# EAGLE design Angin_Arus_LM2596 (EAGLE 7.6.0)
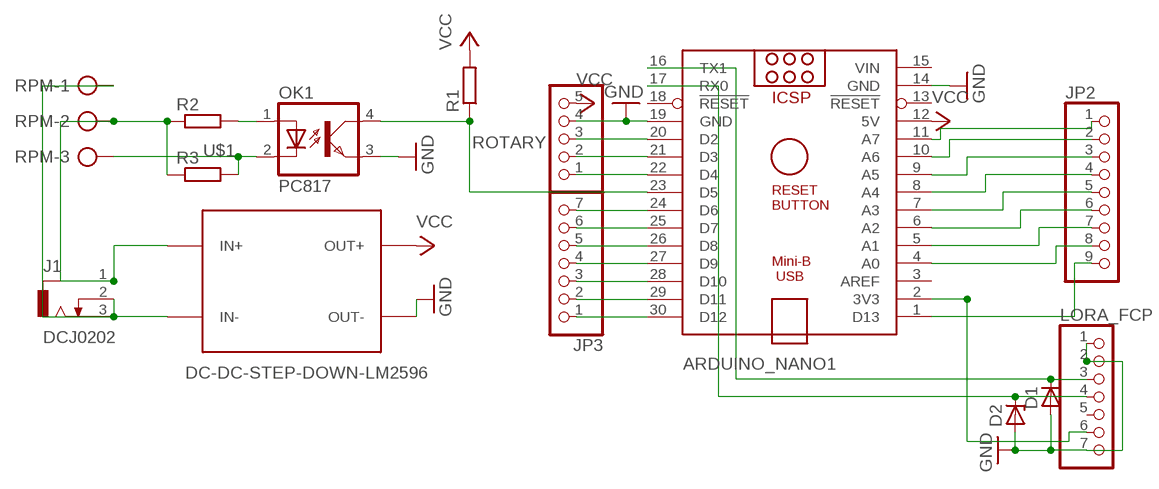
[diagram p0: schematic, sheet 1]

## Parts
ARDUINO_NANO1  ARDUINO_NANO  [ARDUINO_NANO]
D1  ZENER-DIODEDO35Z10  [DO35Z10]
D2  ZENER-DIODEDO35Z10  [DO35Z10]
J1  DCJ0202  [DCJ0202]
JP2  PINHD-1X9  [1X09]
JP3  PINHD-1X7  [1X07]
LORA_FCP  PINHD-1X7  [1X07]
OK1  PC817  [DIL04]
R1  R-EU_0204/7  [0204/7]
R2  R-EU_0204/7  [0204/7]
R3  R-EU_0204/7  [0204/7]
ROTARY  PINHD-1X5  [1X05]
RPM  AK300/3  [AK300/3]
U$1  DC-DC-STEP-DOWN-LM2596  [DC-DC-STEP-DOWN-LM2596]

## Nets
3.3V: ARDUINO_NANO1.2(3V3) LORA_FCP.6
12V: J1.1 R2.1 R3.1 RPM.2 U$1.IN+
GND: ARDUINO_NANO1.14(GND) ARDUINO_NANO1.19(GND) D1.A D2.A LORA_FCP.1 LORA_FCP.2 LORA_FCP.7 OK1.3(EMIT) ROTARY.4 U$1.OUT-
GND12V: J1.2 J1.3 RPM.1 U$1.IN-
N$1: ARDUINO_NANO1.23(D5) OK1.4(COL) R1.1
N$2: OK1.1(A) R2.2
N$4: ARDUINO_NANO1.20(D2) ROTARY.3
N$5: ARDUINO_NANO1.21(D3) ROTARY.2
N$6: ARDUINO_NANO1.22(D4) ROTARY.1
N$7: ARDUINO_NANO1.8(A4) JP2.4
N$9: ARDUINO_NANO1.1(D13) JP2.9
N$10: ARDUINO_NANO1.4(A0) JP2.8
N$11: ARDUINO_NANO1.5(A1) JP2.7
N$12: ARDUINO_NANO1.6(A2) JP2.6
N$13: ARDUINO_NANO1.7(A3) JP2.5
N$14: ARDUINO_NANO1.9(A5) JP2.3
N$15: ARDUINO_NANO1.10(A6) JP2.2
N$16: ARDUINO_NANO1.11(A7) JP2.1
N$18: ARDUINO_NANO1.30(D12) JP3.1
N$19: ARDUINO_NANO1.29(D11) JP3.2
N$20: ARDUINO_NANO1.28(D10) JP3.3
N$21: ARDUINO_NANO1.27(D9) JP3.4
N$22: ARDUINO_NANO1.26(D8) JP3.5
N$23: ARDUINO_NANO1.25(D7) JP3.6
N$24: ARDUINO_NANO1.24(D6) JP3.7
RX: ARDUINO_NANO1.16(TX1) D1.C LORA_FCP.3
SIGNAL: OK1.2(C) R3.2 RPM.3
TX: ARDUINO_NANO1.17(RX0) D2.C LORA_FCP.4
VCC: ARDUINO_NANO1.12(5V) R1.2 ROTARY.5 U$1.OUT+
Unconnected: ARDUINO_NANO1.3(AREF) ARDUINO_NANO1.13(!RESET) ARDUINO_NANO1.18(!RESET) LORA_FCP.5

## Power pins joined to a net without a drawn wire
VIN: ARDUINO_NANO1.15(VIN)

## Library data of the parts
ARDUINO_NANO1 = ArduinoNanoV30:ARDUINO_NANO: Arduino Nano V3.0 Overview: The Arduino Nano is a small, complete, and breadboard-friendly board based on the ATmega328 (Arduino Nano 3.x) or ATmega168 (Arduino Nano 2.x). It has more or less the same functionality of the Arduino Duemilanove, but in a different package. It lacks only a DC power jack, and works with a Mini-B USB cable instead of a standard one. The Nano was designed and is being produced by Gravitech. Specifications: Microcontroller Atmel ATmega168 or ATmega328 Operating Voltage (logic level) 5 V Input Voltage (recommended) 7-12 V Input Voltage (limits) 6-20 V Digital I/O Pins 14 (of which 6 provide PWM output) Analog Input Pins 8 DC Current per I/O Pin 40 mA Flash Memory 16 KB (ATmega168) or 32 KB (ATmega328) of which 2 KB used by bootloader SRAM 1 KB (ATmega168) or 2 KB (ATmega328) EEPROM 512 bytes (ATmega168) or 1 KB (ATmega328) Clock Speed 16 MHz Dimensions 0.73" x 1.70" Length 45 mm Width 18 mm Weigth 5 g Power: The Arduino Nano can be powered via the Mini-B USB connection, 6-20V unregulated external power supply (pin 30), or 5V regulated external power supply (pin 27). The power source is automatically selected to the highest voltage source. Memory: The ATmega168 has 16 KB of flash memory for storing code (of which 2 KB is used for the bootloader); the ATmega328 has 32 KB, (also with 2 KB used for the bootloader). The ATmega168 has 1 KB of SRAM and 512 bytes of EEPROM (which can be read and written with the EEPROM library); the ATmega328 has 2 KB of SRAM and 1 KB of EEPROM. Input and Output: Each of the 14 digital pins on the Nano can be used as an input or output, using pinMode(), digitalWrite(), and digitalRead() functions. They operate at 5 volts. Each pin can provide or receive a maximum of 40 mA and has an internal pull-up resistor (disconnected by default) of 20-50 kOhms. In addition, some pins have specialized functions. Visit Arduino - ArduinoBoardNano <https://www.arduino.cc/en/Main/ArduinoBoardNano>
D1 D2 = diode:ZENER-DIODE: Z-Diode
J1 = con-jack:DCJ0202: DC POWER JACK Source: DCJ0202.pdf; OC_FARNELL: unknown; OC_NEWARK: unknown
JP2 = pinhead:PINHD-1X9: PIN HEADER
JP3 LORA_FCP = pinhead:PINHD-1X7: PIN HEADER
OK1 = optocoupler:PC817: SHARP OPTO COUPLER; MPN: PC817X4J000F; OC_FARNELL: 9707727; OC_NEWARK: 97K7059
R1-R3 = rcl:R-EU_: RESISTOR, European symbol
ROTARY = pinhead:PINHD-1X5: PIN HEADER
RPM = con-ptr500:AK300/3: CONNECTOR; OC_FARNELL: unknown; OC_NEWARK: unknown
U$1 = diy-modules:DC-DC-STEP-DOWN-LM2596: DC/DC Step-Down Regulator based on LM2596-ADJ chip LM2596 datasheet available here: http://www.ti.com/lit/ds/symlink/lm2596.pdf Click here to find device on ebay.com <http://www.ebay.com/sch/lm2596+power+regulator>

## Board
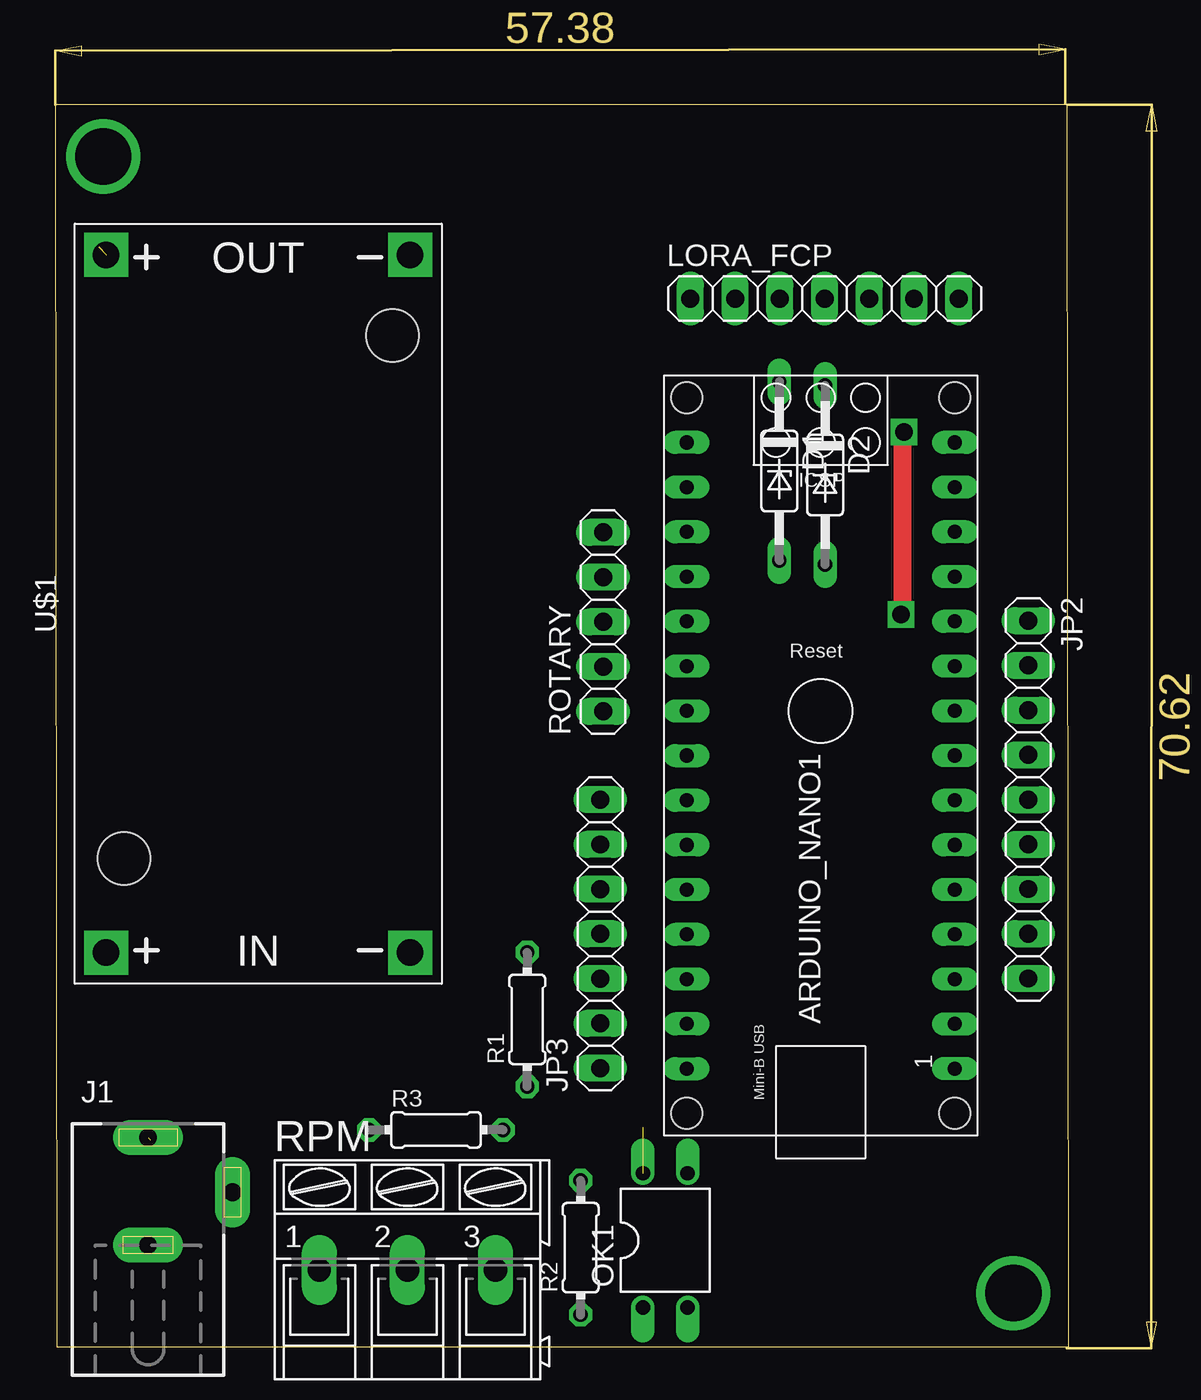
[diagram p1: board, top side]
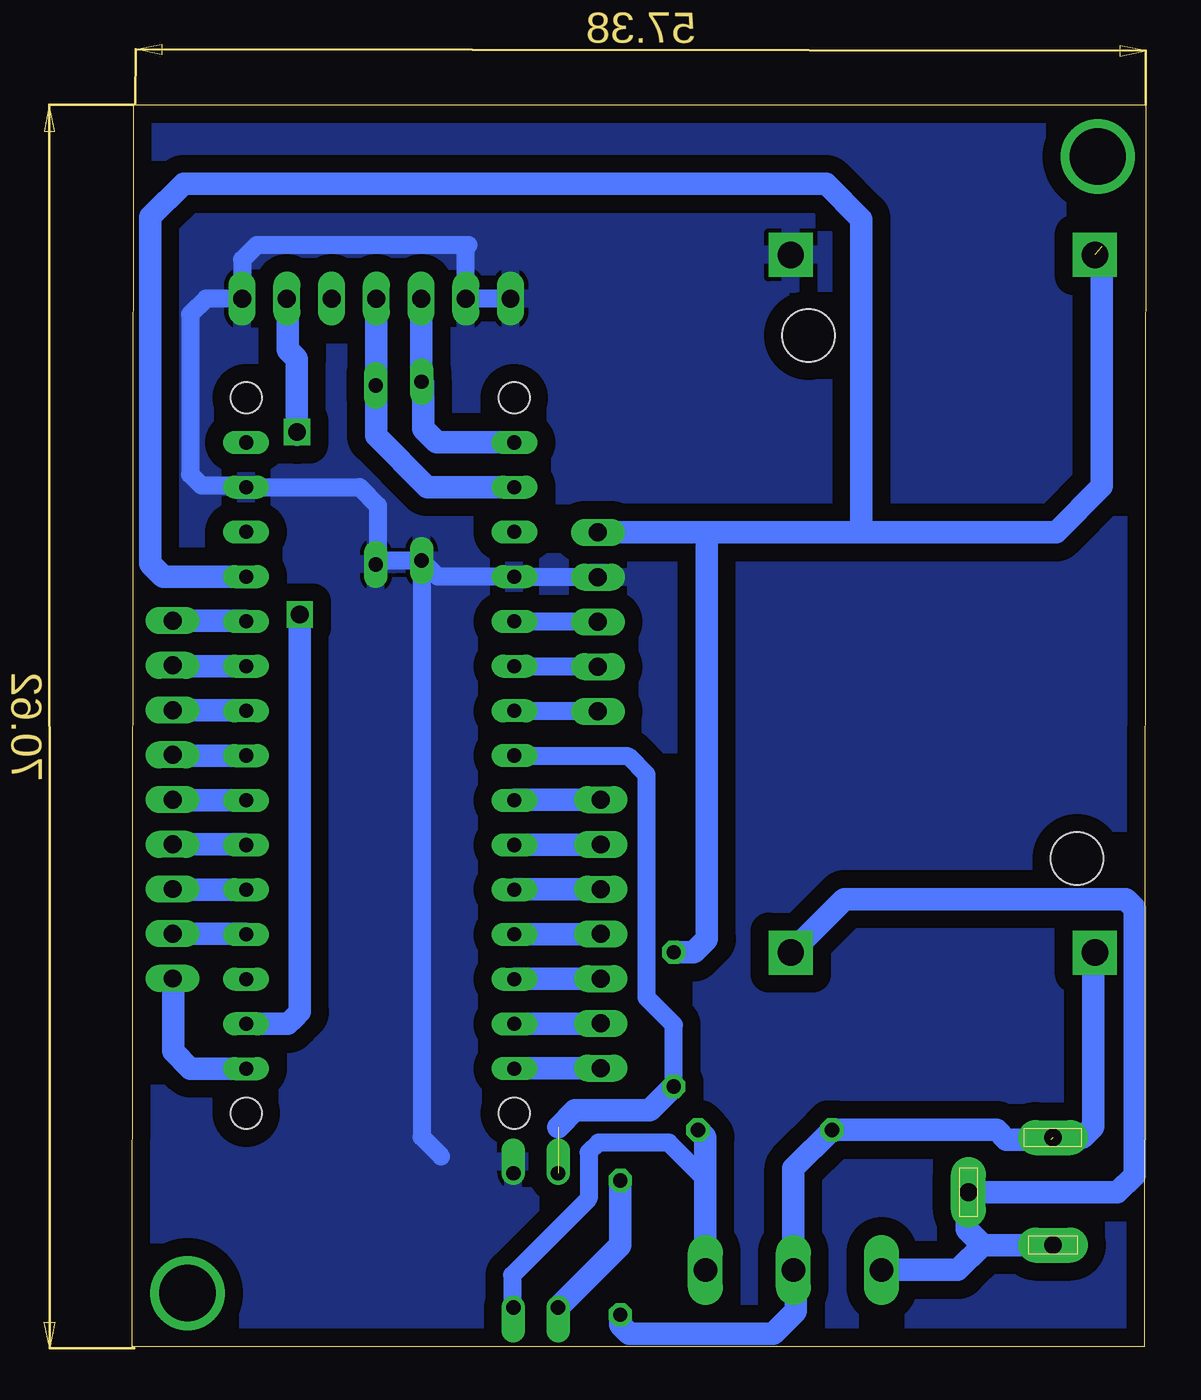
[diagram p2: board, bottom side, seen from below]

Size 57.57 x 70.53 mm. Coordinates in mm from the lower left corner, seen from the top.
Outline: 0.09,0 57.57,0 57.48,70.53 0,70.53 0.09,0
Copper layers (1*16): Top 0.035mm / dielectric 1.5mm / Bottom 0.035mm
Design rules "default": minimum track width 10mil, minimum drill 24mil, track to track 8mil, track to pad 8mil, pad to pad 8mil, via to via 8mil, smd to smd 8mil, copper to edge 40mil, drill to drill 8mil, minimum pad ring 10mil, minimum via ring 8mil, stop-mask expansion 4mil, vias tented up to drill 0mil, thermal gap 10mil

### Footprints (pad centres in the part's own frame; a part is rotated, then mirrored left to right if it is on the bottom)
ARDUINO_NANO = drill 0.8 long: 1 -20.32,-7.62; 2 -17.78,-7.62; 3 -15.24,-7.62; 4 -12.7,-7.62; 5 -10.16,-7.62; 6 -7.62,-7.62; 7 -5.08,-7.62; 8 -2.54,-7.62; 9 0,-7.62; 10 2.54,-7.62; 11 5.08,-7.62; 12 7.62,-7.62; 13 10.16,-7.62; 14 12.7,-7.62; 15 15.24,-7.62; 16 15.24,7.62; 17 12.7,7.62; 18 10.16,7.62; 19 7.62,7.62; 20 5.08,7.62; 21 2.54,7.62; 22 0,7.62; 23 -2.54,7.62; 24 -5.08,7.62; 25 -7.62,7.62; 26 -10.16,7.62; 27 -12.7,7.62; 28 -15.24,7.62; 29 -17.78,7.62; 30 -20.32,7.62 | hole 1.778: -22.86,-7.62; -22.86,7.62; 17.78,7.62; 17.78,-7.62
DO35Z10 = drill 0.813 long: A 5.08,0; C -5.08,0
DCJ0202 = drill 1 pad 2 long: 1 0,3.1; 2 4.8,0; 3 0,-3
1X09 = drill 1.016 long: 1 -10.16,0; 2 -7.62,0; 3 -5.08,0; 4 -2.54,0; 5 0,0; 6 2.54,0; 7 5.08,0; 8 7.62,0; 9 10.16,0
1X07 = drill 1.016 long: 1 -7.62,0; 2 -5.08,0; 3 -2.54,0; 4 0,0; 5 2.54,0; 6 5.08,0; 7 7.62,0
DIL04 = drill 0.813 offset: 1 -1.27,-3.81; 2 1.27,-3.81; 3 1.27,3.81; 4 -1.27,3.81
0204/7 = drill 0.813 octagon: 1 -3.81,0; 2 3.81,0
1X05 = drill 1.016 long: 1 -5.08,0; 2 -2.54,0; 3 0,0; 4 2.54,0; 5 5.08,0
AK300/3 = drill 1.321 long: 1 -5.004,0; 2 0,0; 3 5.004,0
DC-DC-STEP-DOWN-LM2596 = drill 1.5 pad 2.5 square: IN+ -19.812,8.636; IN- -19.812,-8.636; OUT+ 19.812,8.636; OUT- 19.812,-8.636 | hole 3: -14.478,7.62; 15.24,-7.62

### Placement (x,y rotation side)
ARDUINO_NANO1  43.48,36.12 90 top
D1  41.13,49.73 270 top
D2  43.73,49.51 270 top
J1  5.28,8.78 0 top
JP2  55.27,31.08 270 top
JP3  30.96,23.45 90 top
LORA_FCP  43.7,59.53 0 top
OK1  34.65,6.04 0 top
R1  26.81,18.59 90 top
R2  29.84,5.63 90 top
R3  21.63,12.32 0 top
ROTARY  31.12,41.17 90 top
RPM  20.01,4.37 0 top
U$1  11.53,42.2 90 top

### Tracks (layer width: path | path; a pad name or v marks a point on that pad's centre or on a via)
3.3V  (via drill 1)
  Top 1.016: v48.05,41.58 48.13,41.58 48.13,51.87 v48.21,51.95
  Bottom 1.016: v48.21,51.95 48.21,51.8 48.22,51.79 | 48.73,59.48 LORA_FCP.6
  Bottom 1.27: v48.05,41.58 48.05,19.02 48.37,18.7 48.73,18.34 ARDUINO_NANO1.2 | 48.22,51.79 48.22,56.12 48.73,56.63 48.73,59.48
12V  (1 unrouted)
  Bottom 1.27: 5.39,11.77 7.93,11.77 8.48,12.32 R3.1 20.01,10.13 RPM.2 19.88,4.24 19.88,2.02 21.15,0.75 29.33,0.75 29.84,1.26 R2.1 | J1.1 3.61,11.88 3,12.49 3,22.28 U$1.IN+
GND
  Bottom 1.016: LORA_FCP.1 LORA_FCP.2 38.62,62.42 38.47,62.57 50.49,62.57 51.32,61.74 LORA_FCP.7 53.37,59.53 54.27,58.63 54.27,49.55 53.64,48.92 51.2,48.92 ARDUINO_NANO1.14 44.65,48.82 43.61,47.78 43.61,44.55 D2.A 43.51,44.65 D1.A | D1.A 41.13,11.92 40.02,10.81 | ROTARY.4 31.15,43.74 ARDUINO_NANO1.19 40.22,43.74 D1.A
  pour Bottom (isolate 1.016): 57.46,70.6 57.46,-0.09 0.21,-0.09 0.21,70.6
GND12V
  Bottom 1.27: J1.3 9.26,5.78 | 9.26,5.78 10.17,6.69 10.17,8.69 J1.2 1.61,8.78 0.64,9.75 0.64,24.92 1.15,25.43 17.12,25.43 U$1.IN- | RPM.1 10.67,4.37 9.26,5.78
N$1  (1 unrouted)
  Bottom 1.016: R1.1 26.81,18.29 28.35,19.83 28.35,32.5 29.38,33.53 35.81,33.53 ARDUINO_NANO1.23
  Bottom 1.27: 33.38,12.47 32.42,13.43 28.16,13.43 R1.1
N$2
  Bottom 1.27: R2.2 29.84,5.77 OK1.1
N$4
  Bottom 1.016: ROTARY.3 35.83,41.17 ARDUINO_NANO1.20
N$5
  Bottom 1.016: ARDUINO_NANO1.21 31.15,38.66 ROTARY.2
N$6
  Bottom 1.016: ROTARY.1 35.83,36.09 ARDUINO_NANO1.22
N$7
  Bottom 1.27: ARDUINO_NANO1.8 55.23,33.58 JP2.4
N$8  (via drill 3.2)
  other vias: 2.73,67.6
N$9
  Bottom 1.27: ARDUINO_NANO1.1 54.26,15.8 55.24,16.78 55.24,20.89 JP2.9
N$10
  Bottom 1.27: JP2.8 51.14,23.46 ARDUINO_NANO1.4
N$11
  Bottom 1.27: ARDUINO_NANO1.5 55.23,25.96 JP2.7
N$12
  Bottom 1.27: JP2.6 51.14,28.54 ARDUINO_NANO1.6
N$13
  Bottom 1.27: ARDUINO_NANO1.7 55.23,31.04 JP2.5
N$14
  Bottom 1.27: JP2.3 51.14,36.16 ARDUINO_NANO1.9
N$15
  Bottom 1.27: ARDUINO_NANO1.10 55.23,38.66 JP2.2
N$16
  Bottom 1.27: JP2.1 51.14,41.24 ARDUINO_NANO1.11
N$18
  Bottom 1.016: 35.83,15.83 ARDUINO_NANO1.30
  Bottom 1.27: JP3.1 35.83,15.83
N$19
  Bottom 1.016: 30.99,18.34 JP3.2
  Bottom 1.27: ARDUINO_NANO1.29 30.99,18.34
N$20
  Bottom 1.016: 35.83,20.91 ARDUINO_NANO1.28
  Bottom 1.27: JP3.3 35.83,20.91
N$21
  Bottom 1.016: 30.99,23.42 JP3.4
  Bottom 1.27: ARDUINO_NANO1.27 30.99,23.42
N$22
  Bottom 1.016: 35.83,25.99 ARDUINO_NANO1.26
  Bottom 1.27: JP3.5 35.83,25.99
N$23
  Bottom 1.016: 30.99,28.5 JP3.6
  Bottom 1.27: ARDUINO_NANO1.25 30.99,28.5
N$24
  Bottom 1.016: 35.83,31.07 ARDUINO_NANO1.24
  Bottom 1.27: JP3.7 35.83,31.07
N$25
  pour Bottom (isolate 1.016): 0.09,-0.21 0.09,70.62 57.38,70.62 57.38,65.62 17.48,65.62 17.48,65.48 17.88,65.48 17.88,45.49 25.26,45.49 25.26,17.67 25.37,17.67 25.37,-0.39
N$26  (via drill 3.2)
  other vias: 54.42,3.05
RX
  Bottom 1.016: 41.04,54.72 D1.C 41.16,54.84
  Bottom 1.27: ARDUINO_NANO1.16 40.27,51.36 41.04,52.13 41.04,54.72 | LORA_FCP.3 41.16,54.84
SIGNAL
  Bottom 1.016: 25.47,12.35 R3.2 | RPM.3 25.01,9.52 27.09,11.6 31.08,11.6 31.64,11.04 31.64,8.42 35.99,4.07 35.99,2.3 OK1.2
  Bottom 1.27: RPM.3 25.01,11.89 R3.2
TX
  Bottom 1.016: D2.C 43.7,54.62
  Bottom 1.27: ARDUINO_NANO1.17 40.81,48.82 43.72,51.73 D2.C | LORA_FCP.4 43.7,54.62
VCC  (1 unrouted)
  Bottom 1.27: ROTARY.5 24.8,46.25 | 24.8,46.25 16.38,46.25 | 16.38,46.25 5.1,46.25 2.49,48.86 2.49,62.48 | R1.2 25.68,22.4 24.93,23.16 24.93,46.12 24.8,46.25 | ARDUINO_NANO1.12 55.81,43.74 56.53,44.46 56.53,64.17 54.65,66.05 18.16,66.05 16.16,64.05 16.16,46.47 16.38,46.25